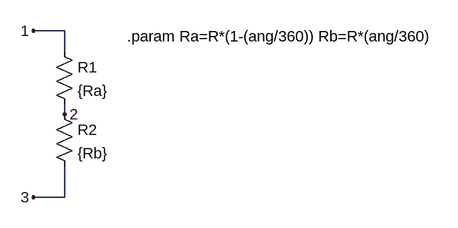
[diagram p0: schematic pot.asc]
pot.asc, the LTspice schematic file:
SHEET 1 880 680
WIRE 128 32 80 32
WIRE 128 64 128 32
WIRE 128 160 128 144
WIRE 128 288 128 240
WIRE 128 288 80 288
FLAG 80 32 1
FLAG 128 160 2
FLAG 80 288 3
SYMBOL res 112 48 R0
SYMATTR InstName R1
SYMATTR Value {Ra}
SYMBOL res 112 144 R0
SYMATTR InstName R2
SYMATTR Value {Rb}
TEXT 224 40 Left 2 !.param Ra=R*(1-(ang/360)) Rb=R*(ang/360)

The netlist it stands for:
* pot.asc
R1 1 2 {Ra}
R2 2 3 {Rb}
.param Ra=R*(1-(ang/360)) Rb=R*(ang/360)
.backanno
.end